# EAGLE design boardMaster (EAGLE 8.2.0)
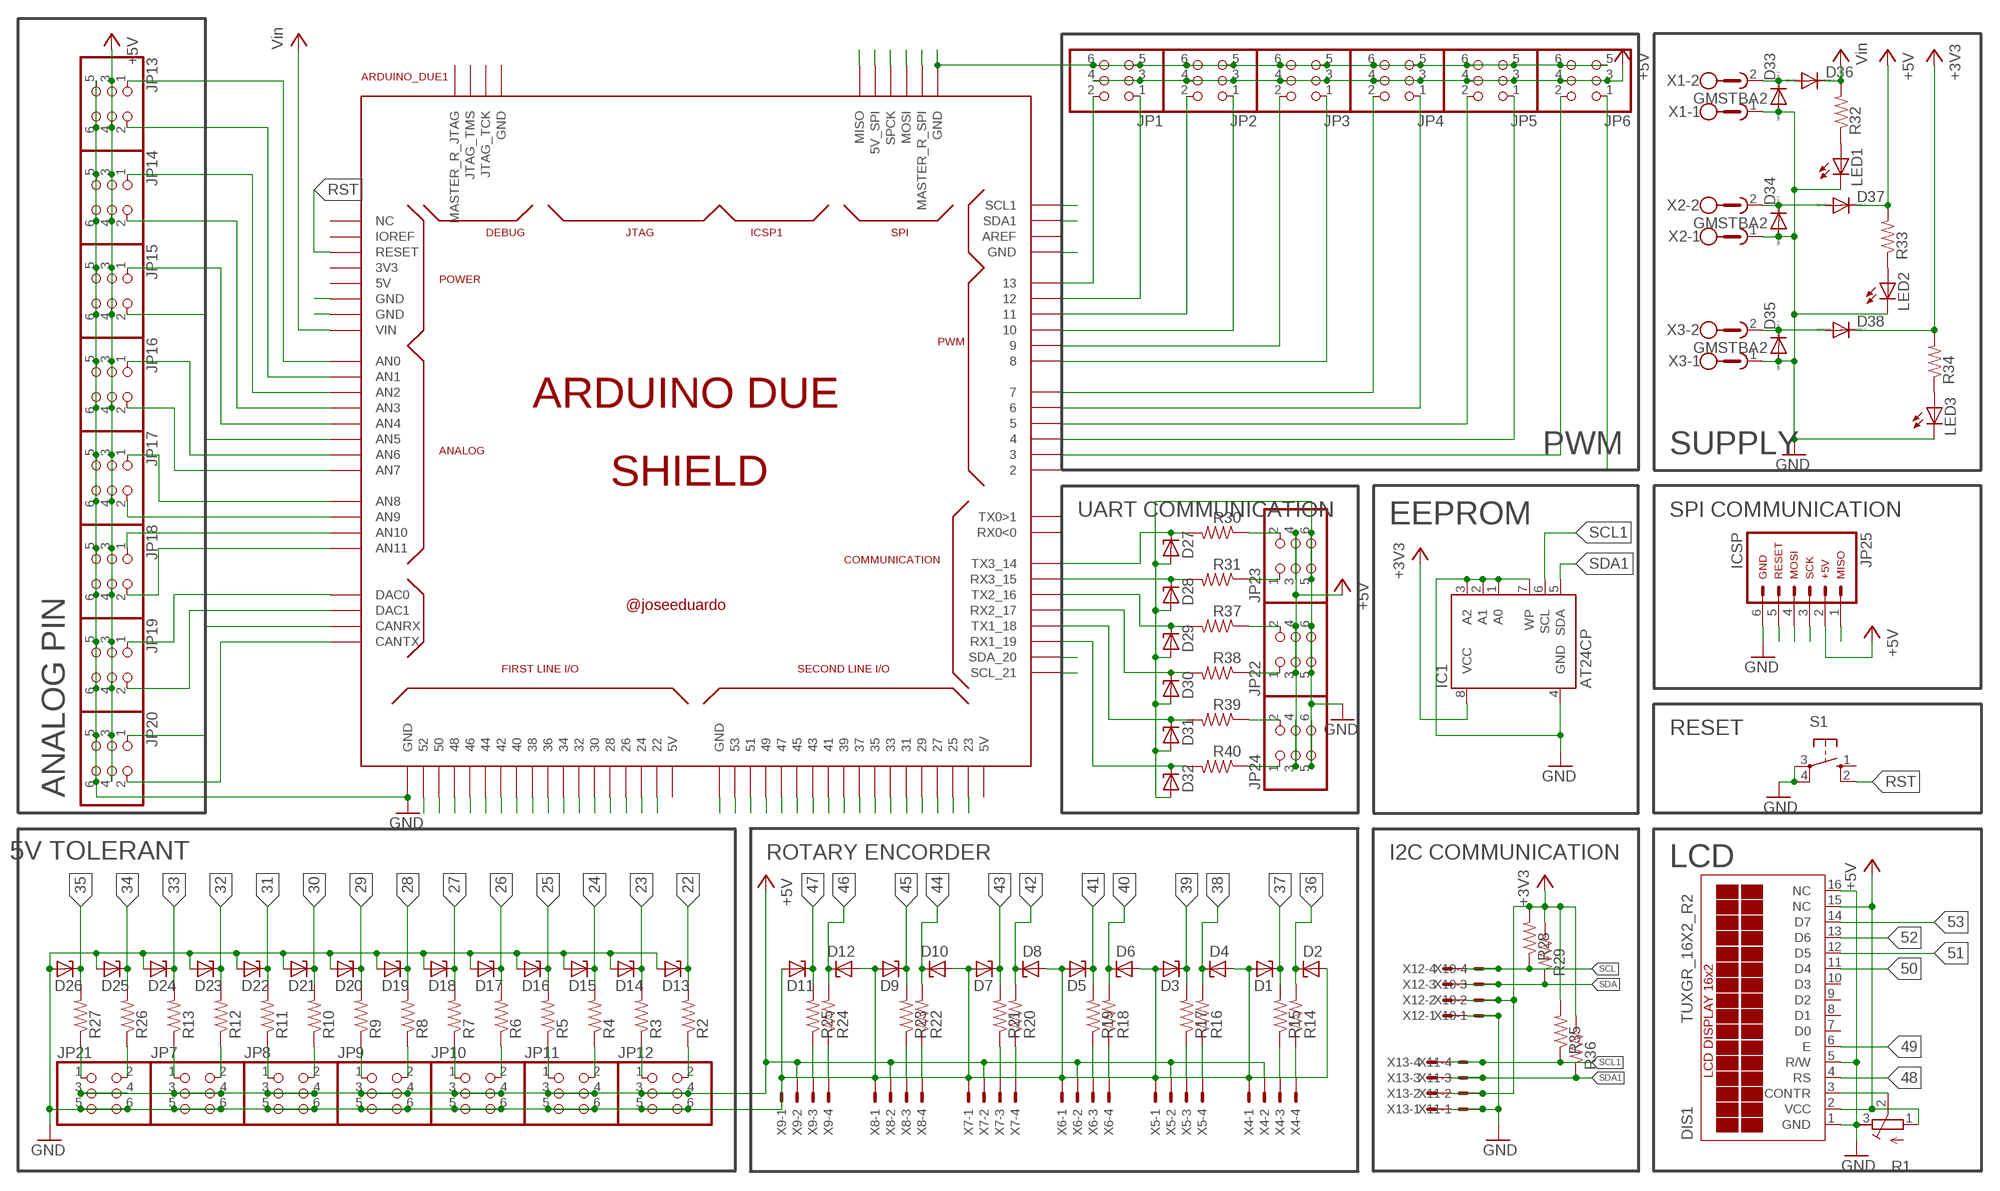
[diagram p0: schematic, sheet 1]

## Parts
ARDUINO_DUE1  ARDUINO_DUE_SHIELD  [ARDUINO_DUE_SHIELD]
D1  ZENER-DIODESOD80C  [SOD80C]
D2  ZENER-DIODESOD80C  [SOD80C]
D3  ZENER-DIODESOD80C  [SOD80C]
D4  ZENER-DIODESOD80C  [SOD80C]
D5  ZENER-DIODESOD80C  [SOD80C]
D6  ZENER-DIODESOD80C  [SOD80C]
D7  ZENER-DIODESOD80C  [SOD80C]
D8  ZENER-DIODESOD80C  [SOD80C]
D9  ZENER-DIODESOD80C  [SOD80C]
D10  ZENER-DIODESOD80C  [SOD80C]
D11  ZENER-DIODESOD80C  [SOD80C]
D12  ZENER-DIODESOD80C  [SOD80C]
D13  ZENER-DIODESOD80C  [SOD80C]
D14  ZENER-DIODESOD80C  [SOD80C]
D15  ZENER-DIODESOD80C  [SOD80C]
D16  ZENER-DIODESOD80C  [SOD80C]
D17  ZENER-DIODESOD80C  [SOD80C]
D18  ZENER-DIODESOD80C  [SOD80C]
D19  ZENER-DIODESOD80C  [SOD80C]
D20  ZENER-DIODESOD80C  [SOD80C]
D21  ZENER-DIODESOD80C  [SOD80C]
D22  ZENER-DIODESOD80C  [SOD80C]
D23  ZENER-DIODESOD80C  [SOD80C]
D24  ZENER-DIODESOD80C  [SOD80C]
D25  ZENER-DIODESOD80C  [SOD80C]
D26  ZENER-DIODESOD80C  [SOD80C]
D27  ZENER-DIODESOD80C  [SOD80C]
D28  ZENER-DIODESOD80C  [SOD80C]
D29  ZENER-DIODESOD80C  [SOD80C]
D30  ZENER-DIODESOD80C  [SOD80C]
D31  ZENER-DIODESOD80C  [SOD80C]
D32  ZENER-DIODESOD80C  [SOD80C]
D33  DIODE-DO214AA  [DO214AA]
D34  DIODE-DO214AA  [DO214AA]
D35  DIODE-DO214AA  [DO214AA]
D36  DIODE-DO214AA  [DO214AA]
D37  DIODE-DO214AA  [DO214AA]
D38  DIODE-DO214AA  [DO214AA]
DIS1  TUXGR_16X2_R2  [TUXGR_16X2_R2]
IC1  AT24CP  [DIL08]
JP1  PINHD-2X3  [2X03]
JP2  PINHD-2X3  [2X03]
JP3  PINHD-2X3  [2X03]
JP4  PINHD-2X3  [2X03]
JP5  PINHD-2X3  [2X03]
JP6  PINHD-2X3  [2X03]
JP7  PINHD-2X3  [2X03]
JP8  PINHD-2X3  [2X03]
JP9  PINHD-2X3  [2X03]
JP10  PINHD-2X3  [2X03]
JP11  PINHD-2X3  [2X03]
JP12  PINHD-2X3  [2X03]
JP13  PINHD-2X3  [2X03]
JP14  PINHD-2X3  [2X03]
JP15  PINHD-2X3  [2X03]
JP16  PINHD-2X3  [2X03]
JP17  PINHD-2X3  [2X03]
JP18  PINHD-2X3  [2X03]
JP19  PINHD-2X3  [2X03]
JP20  PINHD-2X3  [2X03]
JP21  PINHD-2X3  [2X03]
JP22  PINHD-2X3  [2X03]
JP23  PINHD-2X3  [2X03]
JP24  PINHD-2X3  [2X03]
JP25  ARDUINO_CONN-ICSP  [CONN-2X03]
LED1  LEDCHIPLED_1206  [CHIPLED_1206]
LED2  LEDCHIPLED_1206  [CHIPLED_1206]
LED3  LEDCHIPLED_1206  [CHIPLED_1206]
R1  R-TRIMM64W  [RTRIM64W]
R2  R-US_R0805  [R0805]
R3  R-US_R0805  [R0805]
R4  R-US_R0805  [R0805]
R5  R-US_R0805  [R0805]
R6  R-US_R0805  [R0805]
R7  R-US_R0805  [R0805]
R8  R-US_R0805  [R0805]
R9  R-US_R0805  [R0805]
R10  R-US_R0805  [R0805]
R11  R-US_R0805  [R0805]
R12  R-US_R0805  [R0805]
R13  R-US_R0805  [R0805]
R14  R-US_R0805  [R0805]
R15  R-US_R0805  [R0805]
R16  R-US_R0805  [R0805]
R17  R-US_R0805  [R0805]
R18  R-US_R0805  [R0805]
R19  R-US_R0805  [R0805]
R20  R-US_R0805  [R0805]
R21  R-US_R0805  [R0805]
R22  R-US_R0805  [R0805]
R23  R-US_R0805  [R0805]
R24  R-US_R0805  [R0805]
R25  R-US_R0805  [R0805]
R26  R-US_R0805  [R0805]
R27  R-US_R0805  [R0805]
R28  R-US_R0805  [R0805]
R29  R-US_R0805  [R0805]
R30  R-US_R0805  [R0805]
R31  R-US_R0805  [R0805]
R32  R-US_R0805  [R0805]
R33  R-US_R0805  [R0805]
R34  R-US_R0805  [R0805]
R35  R-US_R0805  [R0805]
R36  R-US_R0805  [R0805]
R37  R-US_R0805  [R0805]
R38  R-US_R0805  [R0805]
R39  R-US_R0805  [R0805]
R40  R-US_R0805  [R0805]
S1  40-XX  [B3F-40XX]
X1  GMSTBA2  [GMSTBA2]
X2  GMSTBA2  [GMSTBA2]
X3  GMSTBA2  [GMSTBA2]
X4  22-23-2041  [22-23-2041]
X5  22-23-2041  [22-23-2041]
X6  22-23-2041  [22-23-2041]
X7  22-23-2041  [22-23-2041]
X8  22-23-2041  [22-23-2041]
X9  22-23-2041  [22-23-2041]
X10  22-23-2041  [22-23-2041]
X11  22-23-2041  [22-23-2041]
X12  22-23-2041  [22-23-2041]
X13  22-23-2041  [22-23-2041]

## Nets
22: ARDUINO_DUE1.22 D13.C R2.2
23: ARDUINO_DUE1.23 D14.C R3.2
24: ARDUINO_DUE1.24 D15.C R4.2
25: ARDUINO_DUE1.25 D16.C R5.2
26: ARDUINO_DUE1.26 D17.C R6.2
27: ARDUINO_DUE1.27 D18.C R7.2
28: ARDUINO_DUE1.28 D19.C R8.2
29: ARDUINO_DUE1.29 D20.C R9.2
30: ARDUINO_DUE1.30 D21.C R10.2
31: ARDUINO_DUE1.31 D22.C R11.2
32: ARDUINO_DUE1.32 D23.C R12.2
33: ARDUINO_DUE1.33 D24.C R13.2
34: ARDUINO_DUE1.34 D25.C R26.2
35: ARDUINO_DUE1.35 D26.C R27.2
36: ARDUINO_DUE1.36 D2.C R14.2
37: ARDUINO_DUE1.37 D1.C R15.2
38: ARDUINO_DUE1.38 D4.C R16.2
39: ARDUINO_DUE1.39 D3.C R17.2
40: ARDUINO_DUE1.40 D6.C R18.2
41: ARDUINO_DUE1.41 D5.C R19.2
42: ARDUINO_DUE1.42 D8.C R20.2
43: ARDUINO_DUE1.43 D7.C R21.2
44: ARDUINO_DUE1.44 D10.C R22.2
45: ARDUINO_DUE1.45 D9.C R23.2
46: ARDUINO_DUE1.46 D12.C R24.2
47: ARDUINO_DUE1.47 D11.C R25.2
48: ARDUINO_DUE1.48 DIS1.4(RS)
49: ARDUINO_DUE1.49 DIS1.6(E)
50: ARDUINO_DUE1.50 DIS1.11(D4)
51: ARDUINO_DUE1.51 DIS1.12(D5)
52: ARDUINO_DUE1.52 DIS1.13(D6)
53: ARDUINO_DUE1.53 DIS1.14(D7)
+3V3: D38.C IC1.8(VCC) R28.2 R29.2 R34.2 R35.2 R36.2 X10.2 X11.2 X12.2 X13.2
+5V: ARDUINO_DUE1.5V_2(5V_SPI) D37.C DIS1.2(VCC) DIS1.15(NC) JP1.3 JP1.4 JP2.3 JP2.4 JP3.3 JP3.4 JP4.3 JP4.4 JP5.3 JP5.4 JP6.3 JP6.4 JP7.3 JP7.4 JP8.3 JP8.4 JP9.3 JP9.4 JP10.3 JP10.4 JP11.3 JP11.4 JP12.3 JP12.4 JP13.3 JP13.4 JP14.3 JP14.4 JP15.3 JP15.4 JP16.3 JP16.4 JP17.3 JP17.4 JP18.3 JP18.4 JP19.3 JP19.4 JP20.3 JP20.4 JP21.3 JP21.4 JP22.3 JP22.4 JP23.3 JP23.4 JP24.3 JP24.4 JP25.2 R1.1(A) R33.2 X4.2 X5.2 X6.2 X7.2 X8.2 X9.2
GND: ARDUINO_DUE1.GND ARDUINO_DUE1.GND_1(GND) ARDUINO_DUE1.GND_2(GND) ARDUINO_DUE1.GND_3(GND) ARDUINO_DUE1.GND_4(GND) ARDUINO_DUE1.GND_5(GND) D1.A D2.A D3.A D4.A D5.A D6.A D7.A D8.A D9.A D10.A D11.A D12.A D13.A D14.A D15.A D16.A D17.A D18.A D19.A D20.A D21.A D22.A D23.A D24.A D25.A D26.A D27.A D28.A D29.A D30.A D31.A D32.A D33.A D34.A D35.A DIS1.1(GND) DIS1.5(R/W) DIS1.16(NC) IC1.1(A0) IC1.2(A1) IC1.3(A2) IC1.4(GND) IC1.7(WP) JP1.5 JP1.6 JP2.5 JP2.6 JP3.5 JP3.6 JP4.5 JP4.6 JP5.5 JP5.6 JP6.5 JP6.6 JP7.5 JP7.6 JP8.5 JP8.6 JP9.5 JP9.6 JP10.5 JP10.6 JP11.5 JP11.6 JP12.5 JP12.6 JP13.5 JP13.6 JP14.5 JP14.6 JP15.5 JP15.6 JP16.5 JP16.6 JP17.5 JP17.6 JP18.5 JP18.6 JP19.5 JP19.6 JP20.5 JP20.6 JP21.5 JP21.6 JP22.5 JP22.6 JP23.5 JP23.6 JP24.5 JP24.6 JP25.6 LED1.C LED2.C LED3.C R1.3(E) S1.3(P) S1.4(P1) X1.1 X2.1 X3.1 X4.1 X5.1 X6.1 X7.1 X8.1 X9.1 X10.1 X11.1 X12.1 X13.1
MISO: ARDUINO_DUE1.MISO JP25.1
MOSI: ARDUINO_DUE1.MOSI JP25.4
N$1: ARDUINO_DUE1.A9(AN9) JP17.2
N$2: LED2.A R33.1
N$3: LED3.A R34.1
N$4: LED1.A R32.1
N$5: ARDUINO_DUE1.A0(AN0) JP13.1
N$7: ARDUINO_DUE1.A1(AN1) JP13.2
N$8: ARDUINO_DUE1.A2(AN2) JP14.1
N$9: ARDUINO_DUE1.A3(AN3) JP14.2
N$11: JP21.1 R27.1
N$12: JP21.2 R26.1
N$13: JP7.1 R13.1
N$14: JP7.2 R12.1
N$15: JP8.1 R11.1
N$16: JP8.2 R10.1
N$17: JP9.1 R9.1
N$18: JP9.2 R8.1
N$19: JP10.1 R7.1
N$20: JP10.2 R6.1
N$21: JP11.1 R5.1
N$22: JP11.2 R4.1
N$23: ARDUINO_DUE1.3 JP6.2
N$24: ARDUINO_DUE1.4 JP5.1
N$25: ARDUINO_DUE1.5 JP5.2
N$26: ARDUINO_DUE1.6 JP4.1
N$27: ARDUINO_DUE1.7 JP4.2
N$28: ARDUINO_DUE1.8 JP3.1
N$29: ARDUINO_DUE1.9 JP3.2
N$30: ARDUINO_DUE1.10 JP2.1
N$31: ARDUINO_DUE1.11 JP2.2
N$32: ARDUINO_DUE1.12 JP1.1
N$33: ARDUINO_DUE1.13 JP1.2
N$34: ARDUINO_DUE1.A4(AN4) JP15.1
N$35: ARDUINO_DUE1.A5(AN5) JP15.2
N$36: ARDUINO_DUE1.A6(AN6) JP16.1
N$37: ARDUINO_DUE1.A7(AN7) JP16.2
N$38: ARDUINO_DUE1.A8(AN8) JP17.1
N$39: D33.C D36.A X1.2
N$40: ARDUINO_DUE1.A10(AN10) JP18.1
N$41: ARDUINO_DUE1.A11(AN11) JP18.2
N$42: ARDUINO_DUE1.DAC0 JP19.1
N$43: ARDUINO_DUE1.DAC1 JP19.2
N$44: ARDUINO_DUE1.CANRX JP20.1
N$45: ARDUINO_DUE1.CANTX JP20.2
N$46: JP23.2 R30.1
N$47: JP23.1 R31.1
N$48: D34.C D37.A X2.2
N$49: D35.C D38.A X3.2
N$51: JP22.2 R37.1
N$52: JP22.1 R38.1
N$53: JP24.1 R40.1
N$54: R14.1 X4.4
N$55: JP24.2 R39.1
N$56: JP12.1 R3.1
N$57: JP12.2 R2.1
N$71: R15.1 X4.3
N$73: R16.1 X5.4
N$74: R17.1 X5.3
N$75: R18.1 X6.4
N$76: R19.1 X6.3
N$77: R20.1 X7.4
N$78: R21.1 X7.3
N$79: R22.1 X8.4
N$80: R23.1 X8.3
N$81: R24.1 X9.4
N$82: R25.1 X9.3
N$85: DIS1.3(CONTR) R1.2(S)
N$86: ARDUINO_DUE1.14(TX3_14) D27.C R30.2
N$87: ARDUINO_DUE1.15(RX3_15) D28.C R31.2
N$88: ARDUINO_DUE1.16(TX2_16) D29.C R37.2
N$89: ARDUINO_DUE1.17(RX2_17) D30.C R38.2
N$98: ARDUINO_DUE1.19(RX1_19) D32.C R40.2
N$99: ARDUINO_DUE1.2 JP6.1
N$100: ARDUINO_DUE1.18(TX1_18) D31.C R39.2
RST: ARDUINO_DUE1.RESET S1.2(S1)
SCK: ARDUINO_DUE1.SPCK JP25.3
SCL: ARDUINO_DUE1.21(SCL_21) R28.1 X10.4 X12.4
SCL1: ARDUINO_DUE1.SCL1 IC1.6(SCL) R35.1 X11.4 X13.4
SDA: ARDUINO_DUE1.20(SDA_20) R29.1 X10.3 X12.3
SDA1: ARDUINO_DUE1.SDA1 IC1.5(SDA) R36.1 X11.3 X13.3
SS: ARDUINO_DUE1.MASTER_RESET_SPI(MASTER_R_SPI) JP25.5
VCC: ARDUINO_DUE1.VIN D36.C R32.2 ; supply symbol labelled Vin
Unconnected: ARDUINO_DUE1.0(RX0<0) ARDUINO_DUE1.1(TX0>1) ARDUINO_DUE1.3V3 ARDUINO_DUE1.5V0(5V) ARDUINO_DUE1.5V0_1(5V) ARDUINO_DUE1.5V0_2(5V) ARDUINO_DUE1.AREF ARDUINO_DUE1.GND_7(GND) ARDUINO_DUE1.IOREF ARDUINO_DUE1.JTAG_TCK ARDUINO_DUE1.JTAG_TMS ARDUINO_DUE1.MASTER_RESET_JTAG(MASTER_R_JTAG) ARDUINO_DUE1.NC_2(NC) DIS1.7(D0) DIS1.8(D1) DIS1.9(D2) DIS1.10(D3) S1.1(S)

## Notes on the sheet
- PWM | SUPPLY
- UART COMMUNICATION | EEPROM | SPI COMMUNICATION
- RESET
- ANALOG PIN
- LCD
- 5V TOLERANT | ROTARY ENCORDER | I2C COMMUNICATION

## Library data of the parts
ARDUINO_DUE1 = arduino_due_shield:ARDUINO_DUE_SHIELD
D1-D32 = diode:ZENER-DIODE: Z-Diode
D33-D38 = diode:DIODE-: DIODE
DIS1 = display-lcd:TUXGR_16X2_R2: Tuxgraphics LCD display 16x2 characters reflective, without background light Source: tuxgr_12x2_r2.pdf; OC_FARNELL: unknown; OC_NEWARK: unknown
IC1 = atmel:AT24C*: 2-wire serial EEPROM; MPN: AT24C1024BW-SH-B; OC_FARNELL: 1362646; OC_NEWARK: 03P2044
JP1-JP24 = pinhead:PINHD-2X3: PIN HEADER
JP25 = arduino_jw:ARDUINO_CONN-ICSP: Arduino ICSP I/O Header This is the ICSP I/O header on the Arduino Uno R3. This connector is labeled with the following pin assignments: MISO +5V SCK MOSI RESET GND NOTE: Be sure you install this connector with the correct orientation on your PCB layout. Pin 1 has a square pad to assist with orientation.
LED1-LED3 = led:LED: LED OSRAM: - CHIPLED LG R971, LG N971, LY N971, LG Q971, LY Q971, LO R971, LY R971 LH N974, LH R974 LS Q976, LO Q976, LY Q976 LO Q996 - Hyper CHIPLED LW Q18S LB Q993, LB Q99A, LB R99A - SideLED LS A670, LO A670, LY A670, LG A670, LP A670 LB A673, LV A673, LT A673, LW A673 LH A674 LY A675 LS A676, LA A676, LO A676, LY A676, LW A676 LS A679, LY A679, LG A679 - Hyper Micro SIDELED® LS Y876, LA Y876, LO Y876, LY Y876 LT Y87S - SmartLED LW L88C, LW L88S LB L89C, LB L89S, LG L890 LS L89K, LO L89K, LY L89K LS L896, LA L896, LO L896, LY L896 - TOPLED LS T670, LO T670, LY T670, LG T670, LP T670 LSG T670, LSP T670, LSY T670, LOP T670, LYG T670 LG T671, LOG T671, LSG T671 LB T673, LV T673, LT T673, LW T673 LH T674 LS T676, LA T676, LO T676, LY T676, LB T676, LH T676, LSB T676, LW T676 LB T67C, LV T67C, LT T67C, LS T67K, LO T67K, LY T67K, LW E67C LS E67B, LA E67B, LO E67B, LY E67B, LB E67C, LV E67C, LT E67C LW T67C LS T679, LY T679, LG T679 LS T770, LO T770, LY T770, LG T770, LP T770 LB T773, LV T773, LT T773, LW T773 LH T774 LS E675, LA E675, LY E675, LS T675 LS T776, LA T776, LO T776, LY T776, LB T776 LHGB T686 LT T68C, LB T68C - Hyper Mini TOPLED® LB M676 - Mini TOPLED Santana® LG M470 LS M47K, LO M47K, LY M47K Source: http://www.osram.convergy.de LUXEON: - LUMILED® LXK2-PW12-R00, LXK2-PW12-S00, LXK2-PW14-U00, LXK2-PW14-V00 LXK2-PM12-R00, LXK2-PM12-S00, LXK2-PM14-U00 LXK2-PE12-Q00, LXK2-PE12-R00, LXK2-PE12-S00, LXK2-PE14-T00, LXK2-PE14-U00 LXK2-PB12-K00, LXK2-PB12-L00, LXK2-PB12-M00, LXK2-PB14-N00, LXK2-PB14-P00, LXK2-PB14-Q00 LXK2-PR12-L00, LXK2-PR12-M00, LXK2-PR14-Q00, LXK2-PR14-R00 LXK2-PD12-Q00, LXK2-PD12-R00, LXK2-PD12-S00 LXK2-PH12-R00, LXK2-PH12-S00 LXK2-PL12-P00, LXK2-PL12-Q00, LXK2-PL12-R00 Source: www.luxeon.com KINGBRIGHT: KA-3528ASYC Source: www.kingbright.com
R1 = rcl:R-TRIMM: Trimm resistor
R2-R40 = rcl:R-US_: RESISTOR, American symbol
S1 = switch-omron:40-XX: OMRON SWITCH
X1-X3 = con-phoenix-762:GMSTBA2: PHOENIX; MF: FARNELL; MPN: 1757242; OC_FARNELL: 3705171; OC_NEWARK: 71C4161
X4-X13 = con-molex:22-23-2041: .100" (2.54mm) Center Header - 4 Pin; MF: MOLEX; MPN: 22-23-2041; OC_FARNELL: 1462920; OC_NEWARK: 38C0355

## Board
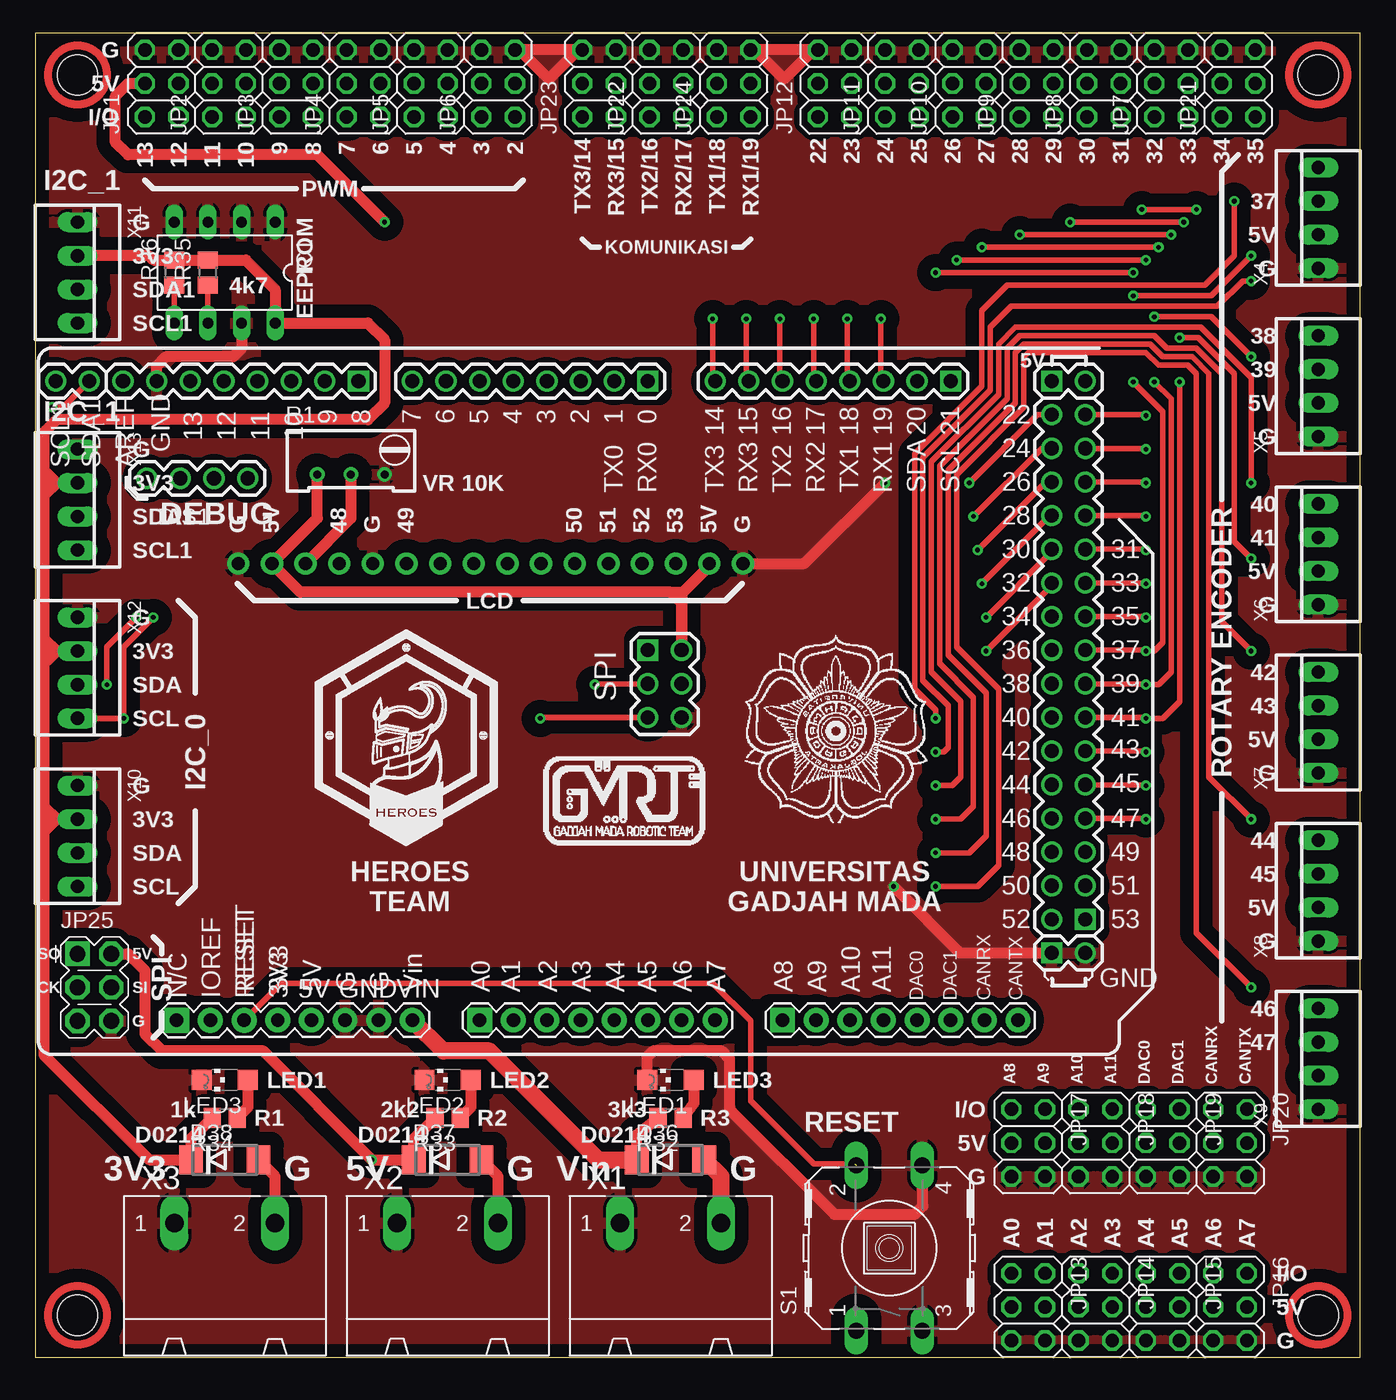
[diagram p1: board, top side]
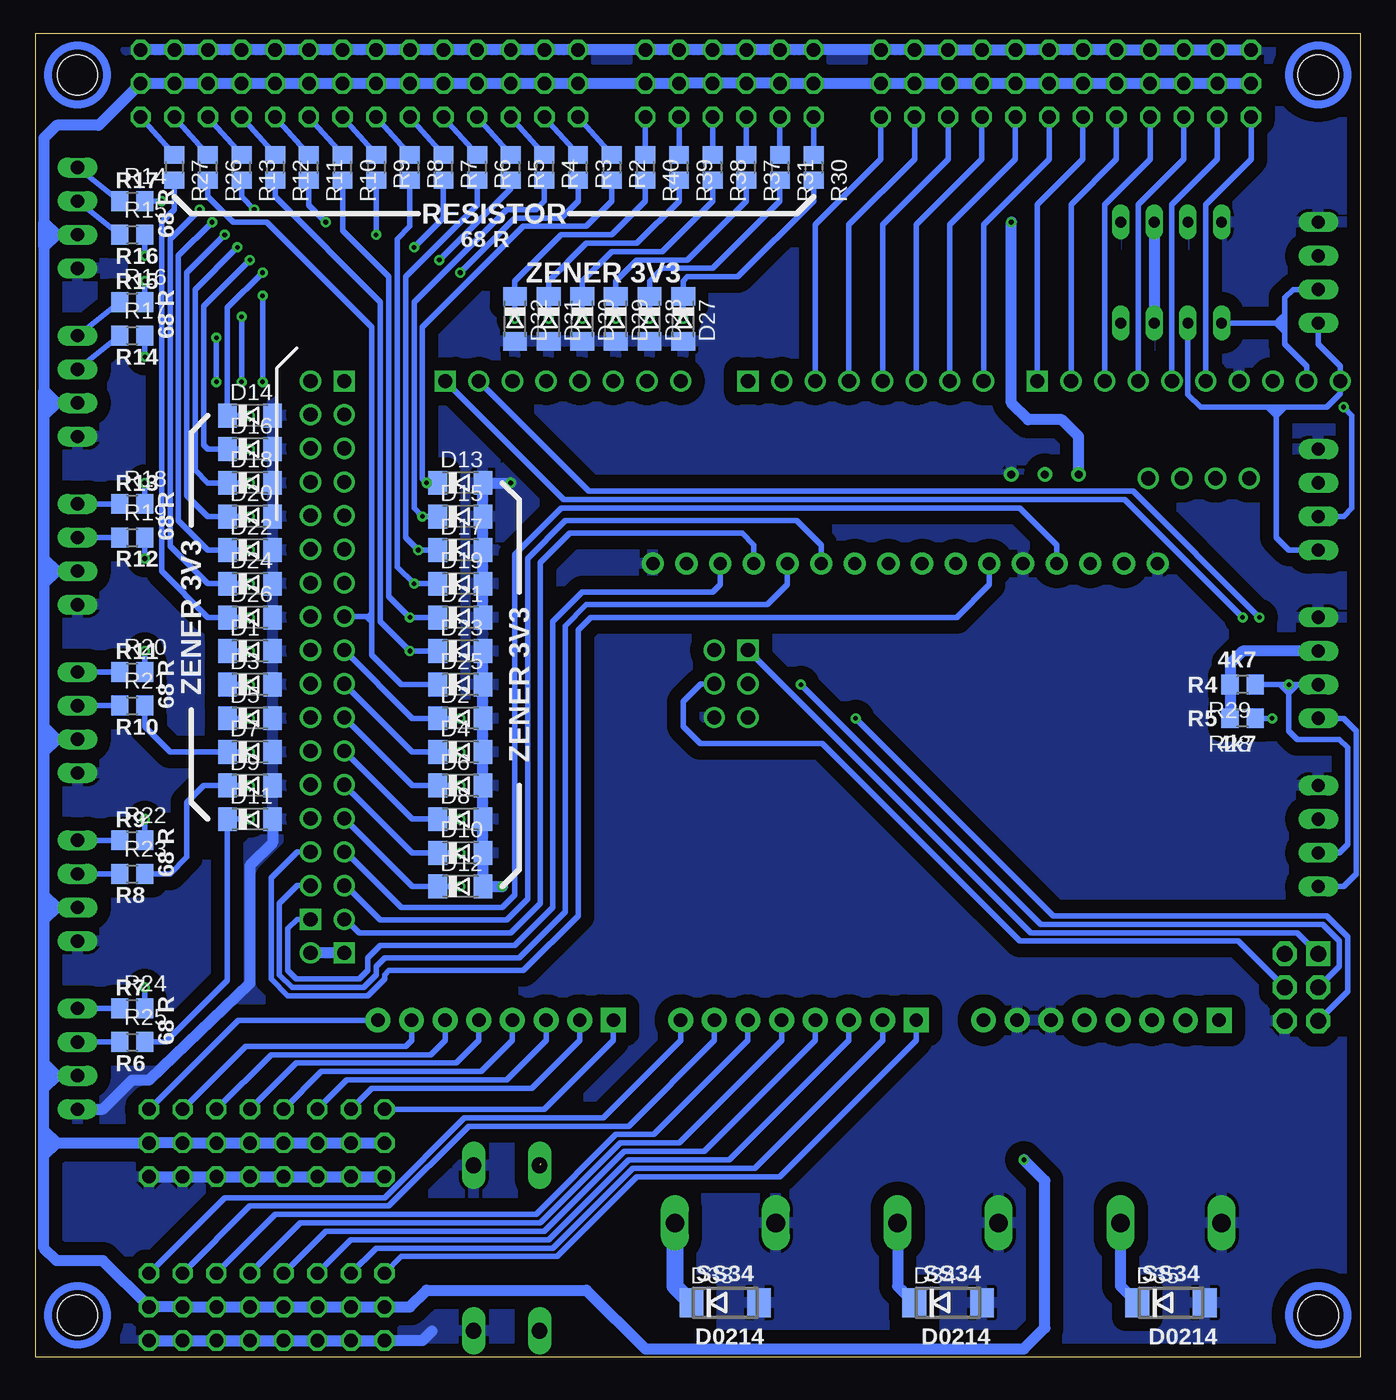
[diagram p2: board, bottom side, seen from below]

Size 100 x 100 mm. Coordinates in mm from the lower left corner, seen from the top.
Outline: 0,0 100,0 100,100 0,100 0,0
Copper layers (1*16): Top 0.035mm / dielectric 1.5mm / Bottom 0.035mm
Design rules "default": minimum track width 6mil, minimum drill 0.35mm, track to track 6mil, track to pad 6mil, pad to pad 6mil, via to via 6mil, smd to smd 6mil, copper to edge 40mil, drill to drill 6mil, minimum pad ring 10mil, minimum via ring 8mil, stop-mask expansion 4mil, vias tented up to drill 0mil, thermal gap 10mil

### Footprints (pad centres in the part's own frame; a part is rotated, then mirrored left to right if it is on the bottom)
ARDUINO_DUE_SHIELD = drill 1.067 square: 0 46.863,50.546; 5V0_1 77.343,50.546; 8 25.019,50.546; 21 69.723,50.546; 53 79.883,9.906; GND_2 77.343,7.366; MISO 46.863,30.226 | drill 1.067: 1 44.323,50.546; 2 41.783,50.546; 3 39.243,50.546; 4 36.703,50.546; 5 34.163,50.546; 5V0_2 79.883,50.546; 5V_2 49.403,30.226; 6 31.623,50.546; 7 29.083,50.546; 9 22.479,50.546; 10 19.939,50.546; 11 17.399,50.546; 12 14.859,50.546; 13 12.319,50.546; 14 51.943,50.546; 15 54.483,50.546; 16 57.023,50.546; 17 59.563,50.546; 18 62.103,50.546; 19 64.643,50.546; 20 67.183,50.546; 22 77.343,48.006; 23 79.883,48.006; 24 77.343,45.466; 25 79.883,45.466; 26 77.343,42.926; 27 79.883,42.926; 28 77.343,40.386; 29 79.883,40.386; 30 77.343,37.846; 31 79.883,37.846; 32 77.343,35.306; 33 79.883,35.306; 34 77.343,32.766; 35 79.883,32.766; 36 77.343,30.226; 37 79.883,30.226; 38 77.343,27.686; 39 79.883,27.686; 40 77.343,25.146; 41 79.883,25.146; 42 77.343,22.606; 43 79.883,22.606; 44 77.343,20.066; 45 79.883,20.066; 46 77.343,17.526; 47 79.883,17.526; 48 77.343,14.986; 49 79.883,14.986; 50 77.343,12.446; 51 79.883,12.446; 52 77.343,9.906; AREF 7.239,50.546; GND_3 79.883,7.366; GND_4 9.779,50.546; GND_5 49.403,25.146; GND_7 16.651,43.203; JTAG_TCK 14.111,43.203; JTAG_TMS 11.571,43.203; MASTER_RESET_JTAG 9.031,43.203; MASTER_RESET_SPI 46.863,25.146; MOSI 49.403,27.686; SCL1 2.159,50.546; SDA1 4.699,50.546; SPCK 46.863,27.686 | drill 1.016 pad 1.88: 3V3 18.923,2.286; 5V0 21.463,2.286; A1 36.703,2.286; A2 39.243,2.286; A3 41.783,2.286; A4 44.323,2.286; A5 46.863,2.286; A6 49.403,2.286; A7 51.943,2.286; A9 59.563,2.286; A10 62.103,2.286; A11 64.643,2.286; CANRX 72.263,2.286; CANTX 74.803,2.286; DAC0 67.183,2.286; DAC1 69.723,2.286; GND 24.003,2.286; GND_1 26.543,2.286; IOREF 13.836,2.273; RESET 16.383,2.285; VIN 29.083,2.286 | drill 1.016 pad 1.88 square: A0 34.163,2.286; A8 57.023,2.286; NC_2 11.296,2.273
SOD80C = smd 1.4 x 1.8: A 1.7,0; C -1.7,0
DO214AA = smd 1.8 x 2.2: A 2.55,0; C -2.55,0
TUXGR_16X2_R2 = drill 1 pad 1.676: 1 -32,15.5; 2 -29.46,15.5; 3 -26.92,15.5; 4 -24.38,15.5; 5 -21.84,15.5; 6 -19.3,15.5; 7 -16.76,15.5; 8 -14.22,15.5; 9 -11.68,15.5; 10 -9.14,15.5; 11 -6.6,15.5; 12 -4.06,15.5; 13 -1.52,15.5; 14 1.02,15.5; 15 3.56,15.5; 16 6.1,15.5
DIL08 = drill 0.813 long: 1 -3.81,-3.81; 2 -1.27,-3.81; 3 1.27,-3.81; 4 3.81,-3.81; 5 3.81,3.81; 6 1.27,3.81; 7 -1.27,3.81; 8 -3.81,3.81
2X03 = drill 1.016 octagon: 1 -2.54,-1.27; 2 -2.54,1.27; 3 0,-1.27; 4 0,1.27; 5 2.54,-1.27; 6 2.54,1.27
CONN-2X03 = drill 1.2 pad 1.829 square: 1 0,0 | drill 1.2 pad 1.829 octagon: 2 2.54,0; 3 0,-2.54; 4 2.54,-2.54; 5 0,-5.08; 6 2.54,-5.08
CHIPLED_1206 = smd 1.5 x 1.5: A 0,-1.75; C 0,1.75
RTRIM64W = drill 0.61: 1 1.27,-2.54; 2 1.27,0; 3 1.27,2.54
R0805 = smd 1.3 x 1.5: 1 -0.95,0; 2 0.95,0
B3F-40XX = drill 1.194 long: 1 -6.248,2.489; 2 6.248,2.489; 3 -6.248,-2.489; 4 6.248,-2.489
HOLE-3MM = hole 3.05: 0,0
GMSTBA2 = drill 1.397 long: 1 -3.81,5.08; 2 3.81,5.08
22-23-2041 = drill 1 long: 1 -3.81,0; 2 -1.27,0; 3 1.27,0; 4 3.81,0

### Placement (x,y rotation side)
ARDUINO_DUE1  -0.64,23.18 0 top
D1  83.82,53.34 0 bottom
D2  67.94,48.26 0 bottom
D3  83.82,50.8 0 bottom
D4  67.94,45.72 0 bottom
D5  83.82,48.26 0 bottom
D6  67.94,43.18 0 bottom
D7  83.82,45.72 0 bottom
D8  67.94,40.64 0 bottom
D9  83.82,43.18 0 bottom
D10  67.94,38.1 0 bottom
D11  83.82,40.64 0 bottom
D12  67.94,35.56 0 bottom
D13  67.94,66.04 0 bottom
D14  83.82,71.12 0 bottom
D15  67.94,63.5 0 bottom
D16  83.82,68.58 0 bottom
D17  67.94,60.96 0 bottom
D18  83.82,66.04 0 bottom
D19  67.94,58.42 0 bottom
D20  83.82,63.5 0 bottom
D21  67.94,55.88 0 bottom
D22  83.82,60.96 0 bottom
D23  67.94,53.34 0 bottom
D24  83.82,58.42 0 bottom
D25  67.94,50.8 0 bottom
D26  83.82,55.88 0 bottom
D27  51.12,78.42 270 bottom
D28  53.66,78.42 270 bottom
D29  56.2,78.42 270 bottom
D30  58.74,78.42 270 bottom
D31  61.28,78.42 270 bottom
D32  63.82,78.42 270 bottom
D33  47.94,4.13 0 bottom
D34  31.11,4.13 0 bottom
D35  14.29,4.13 0 bottom
D36  47.94,14.92 0 top
D37  31.11,14.92 0 top
D38  14.29,14.92 0 top
DIS1  47.31,44.45 0 top
IC1  14.29,81.92 180 top
JP1  9.53,96.2 90 top
JP2  14.61,96.2 90 top
JP3  19.68,96.2 90 top
JP4  24.77,96.2 90 top
JP5  29.84,96.2 90 top
JP6  34.92,96.2 90 top
JP7  85.72,96.2 90 top
JP8  80.64,96.2 90 top
JP9  75.56,96.2 90 top
JP10  70.48,96.2 90 top
JP11  65.41,96.2 90 top
JP12  60.33,96.2 90 top
JP13  74.93,3.81 270 top
JP14  80.01,3.81 270 top
JP15  85.09,3.81 270 top
JP16  90.17,3.81 270 top
JP17  74.93,16.19 270 top
JP18  80.01,16.19 270 top
JP19  85.09,16.19 270 top
JP20  90.17,16.19 270 top
JP21  90.81,96.2 90 top
JP22  47.62,96.2 90 top
JP23  42.55,96.2 90 top
JP24  52.7,96.2 90 top
JP25  3.17,30.48 0 top
LED1  47.94,20.95 90 top
LED2  31.11,20.95 90 top
LED3  14.29,20.95 90 top
R1  23.81,67.94 270 top
R2  56.52,89.85 270 bottom
R3  59.05,89.85 270 bottom
R4  61.59,89.85 270 bottom
R5  64.14,89.85 270 bottom
R6  66.67,89.85 270 bottom
R7  69.22,89.85 270 bottom
R8  71.75,89.85 270 bottom
R9  74.3,89.85 270 bottom
R10  76.83,89.85 270 bottom
R11  79.38,89.85 270 bottom
R12  81.92,89.85 270 bottom
R13  84.45,89.85 270 bottom
R14  92.71,87.31 0 bottom
R15  92.71,84.77 0 bottom
R16  92.71,79.69 0 bottom
R17  92.71,77.15 0 bottom
R18  92.71,64.45 0 bottom
R19  92.71,61.91 0 bottom
R20  92.71,51.75 0 bottom
R21  92.71,49.21 0 bottom
R22  92.71,39.05 0 bottom
R23  92.71,36.51 0 bottom
R24  92.71,26.35 0 bottom
R25  92.71,23.81 0 bottom
R26  87,89.85 270 bottom
R27  89.53,89.85 270 bottom
R28  8.89,48.26 180 bottom
R29  8.89,50.8 180 bottom
R30  41.27,89.85 270 bottom
R31  43.81,89.85 270 bottom
R32  47.94,18.1 180 top
R33  31.11,18.1 180 top
R34  14.29,18.1 180 top
R35  13.02,81.92 90 top
R36  10.48,81.92 90 top
R37  46.35,89.85 270 bottom
R38  48.9,89.85 270 bottom
R39  51.44,89.85 270 bottom
R40  53.98,89.85 270 bottom
S1  64.45,8.26 90 top
U$1  [HOLE-3MM]  3.17,96.84 0 top
U$2  [HOLE-3MM]  3.17,3.17 0 top
U$3  [HOLE-3MM]  96.84,3.17 0 top
U$4  [HOLE-3MM]  96.84,96.84 0 top
X1  47.94,5.08 0 top
X2  31.11,5.08 0 top
X3  14.29,5.08 0 top
X4  96.84,86.04 90 top
X5  96.84,73.34 90 top
X6  96.84,60.64 90 top
X7  96.84,47.94 90 top
X8  96.84,35.24 90 top
X9  96.84,22.54 90 top
X10  3.17,39.37 270 top
X11  3.17,81.92 270 top
X12  3.17,52.07 270 top
X13  3.17,64.77 270 top

### Tracks (layer width: path | path; a pad name or v marks a point on that pad's centre or on a via)
22  (via drill 0.35)
  Top 0.406: ARDUINO_DUE1.22 75.63,71.18 v70.48,66.04
  Bottom 0.406: D13.C v70.48,66.04 70.8,66.36 70.8,77.79 63.18,85.41 58.42,85.41 56.52,87.31 R2.2
23  (via drill 0.35)
  Top 0.406: ARDUINO_DUE1.23 83.76,71.18 v83.82,71.12 | v67.94,81.92 v82.87,81.92
  Bottom 0.406: v83.82,71.12 D14.C 85.52,79.26 v82.87,81.92 | R3.2 59.05,87.31 60.33,86.04 63.82,86.04 v67.94,81.92
24  (via drill 0.35)
  Top 0.406: ARDUINO_DUE1.24 75.95,68.64 v70.8,63.5
  Bottom 0.406: D15.C v70.8,63.5 71.44,64.14 71.44,79.69 64.45,86.68 62.23,86.68 61.59,87.31 R4.2
25  (via drill 0.35)
  Top 0.406: ARDUINO_DUE1.25 83.76,68.64 v83.82,68.58 | v69.53,82.87 v83.82,82.87
  Bottom 0.406: v83.82,68.58 D16.C 87,68.58 87.31,68.9 87.31,79.38 v83.82,82.87 | 63.82,88.58 R5.2 | R5.2 63.98,88.74 R5.2 | R5.2 64.14,88.27 v69.53,82.87
26  (via drill 0.35)
  Top 0.406: ARDUINO_DUE1.26 76.26,66.1 v71.12,60.96
  Bottom 0.406: D17.C v71.12,60.96 72.07,61.91 72.07,81.6 66.67,87 R6.2
27  (via drill 0.35)
  Top 0.406: ARDUINO_DUE1.27 83.76,66.1 v83.82,66.04 | v71.44,83.82 v84.77,83.82
  Bottom 0.406: v83.82,66.04 D18.C 87,66.04 87.95,66.99 87.95,80.64 v84.77,83.82 | R7.2 69.22,86.04 v71.44,83.82
28  (via drill 0.35)
  Top 0.406: ARDUINO_DUE1.28 76.58,63.56 v71.44,58.42
  Bottom 0.406: D19.C v71.44,58.42 72.71,59.69 72.71,84.45 71.75,85.41 R8.2
29  (via drill 0.35)
  Top 0.406: ARDUINO_DUE1.29 83.76,63.56 v83.82,63.5 | v74.3,84.77 v85.72,84.77
  Bottom 0.406: v83.82,63.5 D20.C 87,63.5 88.58,65.09 88.58,81.92 v85.72,84.77 | R9.2 v74.3,84.77
30  (via drill 0.35)
  Top 0.406: ARDUINO_DUE1.30 76.71,60.83 v71.75,55.88
  Bottom 0.406: D21.C v71.75,55.88 73.34,57.47 73.34,81.6 76.83,85.09 R10.2
31  (via drill 0.35)
  Top 0.406: ARDUINO_DUE1.31 83.76,61.02 v83.82,60.96 | v78.11,85.72 v86.68,85.72
  Bottom 0.406: v83.82,60.96 D22.C 87,60.96 89.22,63.18 89.22,83.19 v86.68,85.72 | R11.2 79.38,87 v78.11,85.72
32  (via drill 0.35)
  Top 0.406: ARDUINO_DUE1.32 76.71,58.29 v71.75,53.34
  Bottom 0.406: D23.C v71.75,53.34 73.98,55.56 73.98,79.69 81.92,87.63 R12.2
33  (via drill 0.35)
  Top 0.406: ARDUINO_DUE1.33 83.76,58.48 v83.82,58.42 | v83.5,86.68 v87.63,86.68
  Bottom 0.406: v83.82,58.42 D24.C 87,58.42 89.85,61.28 89.85,84.45 v87.63,86.68 | 84.14,88.9 R13.2 | R13.2 84.14,88.58 | R13.2 84.45,87.63 v83.5,86.68
34
  Bottom 0.406: D25.C 72.39,50.8 74.61,53.02 74.61,55.56 | 74.61,55.88 74.61,55.56 | 74.61,55.88 74.61,56.2 | ARDUINO_DUE1.34 74.68,55.94 74.61,55.88 | 74.61,55.56 74.93,55.88 | 74.61,56.2 74.93,55.88 | 74.93,55.88 74.61,55.88 | R26.2 87,87.63 85.09,85.72 82.55,85.72 74.61,77.79 74.61,56.2
35  (via drill 0.35)
  Top 0.406: ARDUINO_DUE1.35 83.76,55.94 v83.82,55.88
  Bottom 0.406: v83.82,55.88 D26.C 87,55.88 90.49,59.37 90.49,85.72 89.53,86.68 R27.2
36  (via drill 0.35)
  Top 0.406: v67.94,48.26 67.94,48.9 66.36,50.48 66.36,68.26 71.44,73.34 71.44,79.06 73.34,80.96 88.27,80.96 90.49,83.19 v90.49,87.31
  Bottom 0.406: ARDUINO_DUE1.36 71.56,48.26 D2.C v67.94,48.26 | v90.49,87.31 R14.2
37  (via drill 0.35)
  Top 0.406: ARDUINO_DUE1.37 83.76,53.4 v83.82,53.34 84.45,53.34 85.09,53.98 85.09,71.44 v82.87,73.66 | 83.34,80.17 v82.87,80.17 88.74,80.17 v91.76,83.19
  Bottom 0.406: D1.C v83.82,53.34 | v82.87,73.66 v82.87,80.17 | v91.76,83.19 R15.2
38  (via drill 0.35)
  Top 0.406: v67.94,45.72 68.58,45.72 68.9,46.04 68.9,49.21 66.99,51.12 66.99,67.94 72.07,73.03 72.07,77.79 73.66,79.38 89.22,79.38 91.12,81.28 v91.76,81.28
  Bottom 0.406: ARDUINO_DUE1.38 71.56,45.72 D4.C v67.94,45.72 | v91.76,81.28 R16.2
39  (via drill 0.35)
  Top 0.406: ARDUINO_DUE1.39 83.76,50.86 v83.82,50.8 84.77,50.8 85.72,51.75 85.72,72.39 v84.45,73.66 | v91.76,75.56 88.74,78.58 v84.45,78.58
  Bottom 0.406: v83.82,50.8 D3.C | v84.45,73.66 v84.45,78.58 | v91.76,75.56 R17.2
40  (via drill 0.35)
  Top 0.406: v67.94,43.18 69.22,43.18 69.85,43.81 69.85,49.53 67.63,51.75 67.63,67.63 72.71,72.71 72.71,76.52 73.98,77.79 87.95,77.79 91.76,73.98 v91.76,66.04
  Bottom 0.406: ARDUINO_DUE1.40 71.56,43.18 D6.C v67.94,43.18 | R18.2 v91.76,66.04
41  (via drill 0.35)
  Top 0.406: ARDUINO_DUE1.41 83.76,48.32 v83.82,48.26 85.09,48.26 86.36,49.53 v86.36,73.66 | v86.36,76.99 87.79,76.99 90.49,74.3 90.49,61.6 v91.76,60.33
  Bottom 0.406: R19.2 v91.76,60.33 91.76,62.23 | v83.82,48.26 D5.C | v86.36,73.66 v86.36,76.99
42  (via drill 0.35)
  Top 0.406: v67.94,40.64 69.85,40.64 70.8,41.59 70.8,49.85 68.26,52.39 68.26,67.31 73.34,72.39 73.34,76.2 74.3,77.15 84.45,77.15 85.41,76.2 87.63,76.2 89.53,74.3 89.53,55.56 v91.76,53.34
  Bottom 0.406: R20.2 v91.76,53.34 | ARDUINO_DUE1.42 71.56,40.64 D8.C v67.94,40.64
43  (via drill 0.35)
  Top 0.406: ARDUINO_DUE1.43 83.76,45.78 v83.82,45.72
  Bottom 0.406: v83.82,45.72 D7.C 89.85,45.72 91.76,47.62 R21.2
44  (via drill 0.35)
  Top 0.406: v67.94,38.1 70.48,38.1 71.75,39.37 71.75,50.16 68.9,53.02 68.9,66.99 73.98,72.07 73.98,75.88 74.61,76.52 84.14,76.52 85.09,75.56 87.31,75.56 88.58,74.3 88.58,47.31 88.58,45.72 88.58,43.81 v91.76,40.64
  Bottom 0.406: ARDUINO_DUE1.44 71.56,38.1 D10.C v67.94,38.1 | v91.76,40.64 R22.2
45  (via drill 0.35)
  Top 0.406: ARDUINO_DUE1.45 83.76,43.24 v83.82,43.18
  Bottom 0.406: v83.82,43.18 D9.C 87.31,43.18 88.58,41.91 88.58,37.78 89.85,36.51 R23.2 91.12,36.51
46  (via drill 0.35)
  Top 0.406: v67.94,35.56 71.12,35.56 72.71,37.15 72.71,50.48 69.53,53.66 69.53,66.67 74.61,71.75 74.61,75.56 74.93,75.88 83.82,75.88 84.77,74.93 87,74.93 87.63,74.3 87.63,32.07 v91.76,27.94
  Bottom 0.406: ARDUINO_DUE1.46 71.56,35.56 D12.C v67.94,35.56 | v91.76,27.94 R24.2
47  (via drill 0.35)
  Top 0.406: ARDUINO_DUE1.47 83.76,40.7 v83.82,40.64
  Bottom 0.406: v83.82,40.64 D11.C 85.52,28.46 90.17,23.81 R25.2
48
  Bottom 0.406: ARDUINO_DUE1.48 76.58,38.16 72.39,33.97 64.77,33.97 63.82,34.92 63.82,60.64 60.33,64.14 25.72,64.14 22.93,61.34 DIS1.4
49
  Bottom 0.406: ARDUINO_DUE1.49 80.26,38.16 82.23,36.2 82.23,28.57 80.96,27.3 74.93,27.3 73.66,28.57 73.66,28.89 73.34,29.21 63.18,29.21 59.05,33.34 59.05,54.93 58.1,55.88 30.48,55.88 28.01,58.35 DIS1.6
50
  Bottom 0.406: ARDUINO_DUE1.50 76.58,35.62 73.98,33.02 64.45,33.02 62.87,34.61 62.87,60.33 60.01,63.18 42.55,63.18 40.71,61.34 DIS1.11
51
  Bottom 0.406: ARDUINO_DUE1.51 80.26,35.62 81.6,34.29 81.6,28.89 80.64,27.94 75.25,27.94 74.3,28.89 74.3,29.53 73.66,30.16 63.5,30.16 60.01,33.66 60.01,55.24 58.42,56.83 44.77,56.83 43.25,58.35 DIS1.12
52
  Bottom 0.406: ARDUINO_DUE1.52 76.58,33.08 75.56,32.07 64.14,32.07 61.91,34.29 61.91,60.01 59.69,62.23 46.67,62.23 45.79,61.34 DIS1.13
53
  Bottom 0.406: ARDUINO_DUE1.53 80.26,33.08 80.96,32.38 80.96,29.21 80.33,28.57 75.56,28.57 74.93,29.21 74.93,30.16 73.98,31.11 63.82,31.11 60.96,33.97 60.96,55.56 58.74,57.78 48.9,57.78 48.33,58.35 DIS1.14
+3V3
  Top 0.406: 13.02,83.19 R35.2
  Top 0.813: X11.2 8.57,83.19 8.89,82.86 R36.2 R35.2 15.88,82.86 18.1,80.64 IC1.8 25.08,78.11 26.35,76.83 26.35,72.07 25.08,70.8 1.59,70.8 0.64,69.85 0.64,66.99 | R34.2 11.74,16.5 D38.C 8.57,14.92 0.64,22.86 0.64,39.69 | 1.27,66.36 1.59,66.04 | X13.2 1.59,66.04 | 1.59,66.04 0.64,65.09 | 0.64,65.09 0.64,54.29 | 0.64,54.29 1.59,53.34 | X12.2 1.59,53.34 | 1.59,53.34 0.95,52.7 | 0.64,52.39 0.64,41.59 | 0.64,41.59 1.59,40.64 | X10.2 1.59,40.64 | 1.59,40.64 0.64,39.69 | 0.64,65.09 0.64,66.99 | 0.64,66.99 1.27,66.36 | 1.27,66.36 1.27,65.72 | 0.64,54.29 0.64,52.39 | 0.64,52.39 0.95,52.7 | 0.95,52.7 0.95,53.66 | 0.64,39.69 0.64,41.59
  Bottom 0.813: X12.2 8.89,53.34 9.84,52.39 R29.2 R28.2
+5V  (via drill 0.35)
  Top 0.813: R1.1 21.27,63.38 DIS1.2 20,57.78 47.94,57.78 | R33.2 28.57,16.5 D37.C v25.4,14.92 17.14,23.18 9.53,23.18 8.26,24.45 8.26,29.21 6.99,30.48 JP25.2 | v26.35,85.72 21.27,90.81 6.99,90.81 6.03,91.76 6.03,95.25 6.99,96.2 JP1.4 | DIS1.15 50.87,59.76 48.9,57.78 48.58,57.78 | 47.94,57.78 48.58,57.78 | 48.58,57.78 48.77,57.59 ARDUINO_DUE1.5V_2 48.77,56.96 47.94,57.78
  Bottom 0.813: JP1.4 JP1.3 JP2.4 JP2.3 JP3.4 JP3.3 JP4.4 JP4.3 JP5.4 JP5.3 JP6.4 JP6.3 JP23.4 JP23.3 JP22.4 JP22.3 JP24.4 JP24.3 JP12.4 JP12.3 JP11.4 JP11.3 JP10.4 JP10.3 JP9.4 JP9.3 JP8.4 JP8.3 JP7.4 JP7.3 JP21.4 JP21.3 95.25,93.03 98.42,93.03 99.38,92.08 99.38,85.72 | 98.42,84.77 X4.2 | 99.38,83.82 99.38,73.03 | 99.38,73.03 98.42,72.07 | 98.42,84.77 99.38,83.82 | X5.2 98.42,72.07 | 98.42,72.07 99.38,71.12 99.38,60.33 98.42,59.37 | X6.2 98.42,59.37 | 98.42,59.37 99.38,58.42 99.38,47.62 98.42,46.67 | X7.2 98.42,46.67 | 98.42,46.67 99.38,45.72 99.38,34.92 98.42,33.97 | X8.2 98.42,33.97 | 98.42,33.97 99.38,33.02 99.38,22.23 98.42,21.27 | X9.2 98.42,21.27 | 99.38,20.32 98.42,21.27 | JP17.3 JP17.4 JP18.3 JP18.4 JP19.3 JP19.4 JP20.3 JP20.4 98.42,16.19 | 99.38,20.32 99.38,73.03 | 99.38,17.14 98.42,16.19 | 99.38,17.14 99.38,20.32 | 99.38,15.24 99.38,8.26 98.42,7.3 94.93,7.3 JP16.4 JP16.3 JP15.4 JP15.3 JP14.4 JP14.3 JP13.4 JP13.3 71.75,3.81 70.48,5.08 58.42,5.08 53.98,0.64 25.4,0.64 23.81,2.22 23.81,13.34 v25.4,14.92 | 99.38,15.24 98.42,16.19 | 99.38,15.24 99.38,17.14 | 99.38,85.72 98.42,84.77 | 99.38,83.82 99.38,85.72 | R1.1 21.27,69.53 22.54,70.8 25.08,70.8 26.35,72.07 v26.35,85.72
GND  (via drill 0.35)
  Top 0.813: v64.77,35.56 69.79,30.54 ARDUINO_DUE1.GND_2 | DIS1.16 58.05,59.95 v64.14,66.04 | LED1.C 46.19,22.7 46.67,23.18 51.75,23.18 52.39,22.54 52.39,18.73 60.33,10.79 66.36,10.79 66.99,11.43 66.99,14.45 | IC1.7 15.56,76.2 14.92,75.56 9.84,75.56 9.14,74.87 ARDUINO_DUE1.GND_4 | 58.74,98.74 JP24.5 54.29,98.74 56.52,96.52 58.74,98.74 | 58.74,98.74 59.05,99.06 | JP12.6 58.74,98.74 | JP23.6 JP6.5 36.51,98.74 38.73,96.52 40.96,98.74 JP23.6
  Bottom 0.813: JP1.6 JP1.5 JP2.6 JP2.5 JP3.6 JP3.5 JP4.6 JP4.5 JP5.6 JP5.5 JP6.6 JP6.5 40.96,98.74 41.27,99.06 | JP20.6 JP20.5 JP19.6 JP19.5 JP18.6 JP18.5 JP17.6 JP17.5 | JP16.6 JP16.5 JP15.6 JP15.5 JP14.6 JP14.5 JP13.6 JP13.5 70.8,1.27 70.07,2.01 | ARDUINO_DUE1.GND_2 ARDUINO_DUE1.GND_3 | D23.A D25.A D2.A D4.A D6.A D8.A D10.A D12.A v64.77,35.56 | D21.A D19.A D17.A D15.A D13.A v64.14,66.04 | X9.1 94.93,18.73 92.71,20.95 91.44,20.95 83.82,28.26 83.82,37.15 82.12,38.85 D11.A | IC1.2 IC1.7 | JP23.6 JP23.5 JP22.6 JP22.5 JP24.6 JP24.5 JP12.6 JP12.5 JP11.6 JP11.5 JP10.6 JP10.5 JP9.6 JP9.5 JP8.6 JP8.5 JP7.6 JP7.5 JP21.6 JP21.5
  pour Bottom (isolate 1.016): 0,100.33 0,0 100.33,0 100.33,100.33
  pour Top (isolate 1.016): -0.64,100.33 -0.64,0 100.33,0 100.33,100.33
MISO
  Bottom 0.406: JP25.1 4.76,32.07 24.89,32.07 ARDUINO_DUE1.MISO
MOSI
  Bottom 0.406: JP25.4 9.21,31.43 25.72,31.43 40.64,46.35 49.85,46.35 51.12,47.62 51.12,49.53 49.78,50.86 ARDUINO_DUE1.MOSI
N$1
  Bottom 0.406: ARDUINO_DUE1.A9 58.93,23.94 62.55,20.32 74.61,20.32 JP17.2
N$2
  Top 0.813: LED2.A 32.87,18.9 R33.1
N$3
  Top 0.813: LED3.A 16.04,18.9 R34.1
N$4
  Top 0.813: LED1.A 49.69,19.21 R32.1
N$5
  Bottom 0.406: ARDUINO_DUE1.A0 33.53,23.94 43.81,13.65 54.61,13.65 60.64,7.62 72.39,7.62 JP13.1
N$7
  Bottom 0.406: ARDUINO_DUE1.A1 36.07,23.94 45.72,14.29 54.93,14.29 60.96,8.26 74.3,8.26 JP13.2
N$8
  Bottom 0.406: ARDUINO_DUE1.A2 38.61,23.94 47.62,14.92 55.24,14.92 61.28,8.89 76.2,8.89 JP14.1
N$9
  Bottom 0.406: ARDUINO_DUE1.A3 41.15,23.94 49.53,15.56 55.56,15.56 61.59,9.53 78.11,9.53 JP14.2
N$11
  Bottom 0.406: JP21.1 R27.1
N$12
  Bottom 0.406: JP21.2 R26.1
N$13
  Bottom 0.406: JP7.1 R13.1
N$14
  Bottom 0.406: JP7.2 R12.1
N$15
  Bottom 0.406: JP8.1 R11.1
N$16
  Bottom 0.406: JP8.2 R10.1
N$17
  Bottom 0.406: JP9.1 R9.1
N$18
  Bottom 0.406: JP9.2 R8.1
N$19
  Bottom 0.406: JP10.1 R7.1
N$20
  Bottom 0.406: JP10.2 R6.1
N$21
  Bottom 0.406: JP11.1 R5.1
N$22
  Bottom 0.406: JP11.2 R4.1
N$23
  Bottom 0.406: ARDUINO_DUE1.3 38.61,85.53 33.66,90.49 JP6.2
N$24
  Bottom 0.406: ARDUINO_DUE1.4 36.07,85.53 31.11,90.49 JP5.1
N$25
  Bottom 0.406: ARDUINO_DUE1.5 33.53,85.53 28.57,90.49 JP5.2
N$26
  Bottom 0.406: ARDUINO_DUE1.6 30.99,85.53 26.04,90.49 JP4.1
N$27
  Bottom 0.406: ARDUINO_DUE1.7 28.45,85.53 23.5,90.49 JP4.2
N$28
  Bottom 0.406: JP3.1 20.95,90.49 24.38,87.06 ARDUINO_DUE1.8
N$29
  Bottom 0.406: JP3.2 18.41,90.49 21.84,87.06 ARDUINO_DUE1.9
N$30
  Bottom 0.406: JP2.1 15.88,90.49 19.3,87.06 ARDUINO_DUE1.10
N$31
  Bottom 0.406: JP2.2 13.34,90.49 16.76,87.06 ARDUINO_DUE1.11
N$32
  Bottom 0.406: JP1.1 10.79,90.49 14.22,87.06 ARDUINO_DUE1.12
N$33
  Bottom 0.406: JP1.2 8.26,90.49 11.68,87.06 ARDUINO_DUE1.13
N$34
  Bottom 0.406: ARDUINO_DUE1.A4 43.69,23.94 51.44,16.19 55.88,16.19 61.91,10.16 80.01,10.16 JP15.1
N$35
  Bottom 0.406: ARDUINO_DUE1.A5 46.23,23.94 53.34,16.83 56.2,16.83 62.23,10.79 81.92,10.79 JP15.2
N$36
  Bottom 0.406: ARDUINO_DUE1.A6 48.77,23.94 55.24,17.46 67.31,17.46 73.34,11.43 83.82,11.43 JP16.1
N$37
  Bottom 0.406: ARDUINO_DUE1.A7 51.31,23.94 57.15,18.1 67.63,18.1 73.66,12.06 85.72,12.06 JP16.2
N$38
  Bottom 0.406: ARDUINO_DUE1.A8 56.39,23.94 61.59,18.73 JP17.1
N$39
  Top 1.27: D36.A 51.75,13.66 X1.2
  Bottom 1.27: D33.C 51.75,5.39 X1.2
N$40
  Bottom 0.406: ARDUINO_DUE1.A10 61.47,23.94 64.45,20.95 76.52,20.95 JP18.1
N$41
  Bottom 0.406: ARDUINO_DUE1.A11 64.01,23.94 66.36,21.59 78.42,21.59 JP18.2
N$42
  Bottom 0.406: ARDUINO_DUE1.DAC0 66.55,23.94 68.26,22.23 80.33,22.23 JP19.1
N$43
  Bottom 0.406: ARDUINO_DUE1.DAC1 69.09,23.94 70.17,22.86 82.23,22.86 JP19.2
N$44
  Bottom 0.406: ARDUINO_DUE1.CANRX 71.63,23.94 72.07,23.5 84.14,23.5 JP20.1
N$45
  Bottom 0.406: ARDUINO_DUE1.CANTX 84.71,25.46 JP20.2
N$46
  Bottom 0.406: JP23.2 R30.1
N$47
  Bottom 0.406: JP23.1 R31.1
N$48
  Top 0.813: D37.A 34.92,13.66 X2.2
  Bottom 0.813: 34.61,5.08 D34.C | 34.61,5.08 34.92,5.39 | X2.2 34.92,5.39 | 34.92,5.39 34.61,5.08
N$49
  Top 0.813: D38.A 18.1,13.66 X3.2
  Bottom 0.813: D35.C 18.1,5.39 X3.2
N$50
  Top 0.813: 0.95,40.64 1.27,40.64
N$51
  Bottom 0.406: JP22.2 R37.1
N$52
  Bottom 0.406: JP22.1 R38.1
N$53
  Bottom 0.406: JP24.1 R40.1
N$54
  Bottom 0.406: R14.1 X4.4
N$55
  Bottom 0.406: JP24.2 R39.1
N$56
  Bottom 0.406: JP12.1 R3.1
N$57
  Bottom 0.406: JP12.2 R2.1
N$71
  Bottom 0.406: R15.1 X4.3
N$73
  Bottom 0.406: R16.1 X5.4
N$74
  Bottom 0.406: R17.1 X5.3
N$75
  Bottom 0.406: R18.1 X6.4
N$76
  Bottom 0.406: R19.1 X6.3
N$77
  Bottom 0.406: R20.1 X7.4
N$78
  Bottom 0.406: R21.1 X7.3
N$79
  Bottom 0.406: R22.1 X8.4
N$80
  Bottom 0.406: R23.1 X8.3
N$81
  Bottom 0.406: X9.4 R24.1
N$82
  Bottom 0.406: X9.3 R25.1
N$85
  Top 0.813: R1.2 23.81,63.38 DIS1.3
N$86  (via drill 0.35)
  Top 0.406: v51.12,78.42 51.12,73.91 ARDUINO_DUE1.14
  Bottom 0.406: R30.2 41.27,87.31 46.99,81.6 50.8,81.6 51.12,81.28 D27.C v51.12,78.42
N$87  (via drill 0.35)
  Top 0.406: v53.66,78.42 53.66,73.91 ARDUINO_DUE1.15
  Bottom 0.406: R31.2 43.81,87.31 48.9,82.23 52.7,82.23 53.66,81.28 D28.C v53.66,78.42
N$88  (via drill 0.35)
  Top 0.406: v56.2,78.42 56.2,73.91 ARDUINO_DUE1.16
  Bottom 0.406: R37.2 46.35,87.31 50.8,82.87 54.61,82.87 56.2,81.28 D29.C v56.2,78.42
N$89  (via drill 0.35)
  Top 0.406: v58.74,78.42 58.74,73.91 ARDUINO_DUE1.17
  Bottom 0.406: R38.2 48.9,87.31 52.7,83.5 56.52,83.5 58.74,81.28 D30.C v58.74,78.42
N$98  (via drill 0.35)
  Top 0.406: v63.82,78.42 63.82,73.91 ARDUINO_DUE1.19
  Bottom 0.406: R40.2 53.98,87.31 56.52,84.77 60.33,84.77 63.82,81.28 D32.C v63.82,78.42
N$99
  Bottom 0.406: ARDUINO_DUE1.2 41.15,85.53 36.2,90.49 JP6.1
N$100  (via drill 0.35)
  Top 0.406: v61.28,78.42 61.28,73.91 ARDUINO_DUE1.18
  Bottom 0.406: R39.2 51.44,87.31 54.61,84.14 58.42,84.14 61.28,81.28 D31.C v61.28,78.42
RST  (1 unrouted)
  Top 0.406: 61.86,14.61 58.74,14.61 53.98,19.37 53.98,25.4 51.12,28.26 18.54,28.26 ARDUINO_DUE1.RESET
SCK  (via drill 0.35)
  Top 0.406: ARDUINO_DUE1.SPCK 42.29,50.86 v42.23,50.8
  Bottom 0.406: JP25.3 1.59,29.53 1.59,31.43 2.86,32.7 24.13,32.7 v42.23,50.8
SCL  (via drill 0.35)
  Top 0.406: X12.4 v6.67,48.26 6.67,53.66 v8.89,55.88
  Bottom 0.406: ARDUINO_DUE1.21 60.13,64.77 17.78,64.77 v8.89,55.88 | X10.4 1.27,35.56 0.32,36.51 0.32,47.31 1.27,48.26 X12.4 | R28.1 v6.67,48.26
SCL1
  Top 0.406: R35.1 IC1.6
  Bottom 0.406: X11.4 3.17,76.52 1.52,74.87 ARDUINO_DUE1.SCL1 1.52,72.77 2.54,71.75 5.71,71.75 | IC1.6 13.02,72.71 12.06,71.75 6.99,71.75 | 6.35,71.75 5.71,71.75 | 6.35,71.75 6.99,71.75 | X13.4 5.4,60.96 6.35,61.91 6.35,71.12 | 6.35,71.12 6.35,71.75 | 5.71,71.75 6.35,71.12 | 6.35,71.12 6.99,71.75
SDA  (via drill 0.35)
  Top 0.406: v5.4,50.8 5.4,53.66 v7.62,55.88
  Bottom 0.406: ARDUINO_DUE1.20 58.23,65.41 17.14,65.41 v7.62,55.88 | X10.3 1.59,38.1 0.95,38.73 0.95,46.04 1.59,46.67 4.76,46.67 5.4,47.31 5.4,50.16 | 5.4,50.16 4.76,50.8 | 4.76,50.8 X12.3 | 5.4,50.16 5.71,50.48 | 6.03,50.8 R29.1 v5.4,50.8 | 4.76,50.8 v5.4,50.8 | v5.4,50.8 6.03,50.8 | 6.03,50.8 5.71,50.48 | 5.71,50.48 5.4,50.48
SDA1  (via drill 0.35)
  Top 0.406: R36.1 IC1.5 | v1.27,71.75 2.1,71.75 ARDUINO_DUE1.SDA1
  Bottom 0.406: ARDUINO_DUE1.SDA1 4.06,74.87 5.71,76.52 5.71,77.47 | 5.71,78.74 5.71,77.47 | 5.71,78.74 5.71,80.01 5.08,80.64 X11.3 | IC1.5 6.35,78.11 | 6.35,78.11 6.03,78.42 | 6.03,78.42 5.71,78.74 | 6.35,78.11 6.03,77.79 | 5.71,77.47 6.03,77.79 | 6.03,77.79 6.03,78.42 | X13.3 1.27,63.5 0.64,64.14 0.64,71.12 v1.27,71.75
SS  (via drill 0.35)
  Top 0.406: ARDUINO_DUE1.MASTER_RESET_SPI 38.16,48.32 v38.1,48.26
  Bottom 0.406: JP25.5 0.95,27.62 0.95,31.75 2.54,33.34 23.18,33.34 v38.1,48.26
VCC
  Top 0.813: D36.C 45.39,16.82 R32.2
  Top 1.27: ARDUINO_DUE1.VIN 30.78,23.13 34.26,23.13 42.46,14.92 D36.C

### Text on the board
tPlace: G | 5V | I/O | TX3/14 | RX3/15 | TX2/16 | RX2/17 | TX1/18 | RX1/19 | 22 | 23 | 24 | 25 | 26 | 27 | 28 | 29 | 30 | 31 | 32 | 33 | 34 | 35 | 13 | 12 | 11 | 10 | 9 | 8 | 7 | 6 | 5 | 4 | 3 | 2 | I2C_1 | PWM | 37 | G | KOMUNIKASI | 5V | 3V3 | G | 4k7 | SDA1 | EEPROM | SCL1 | 38 | 39 | I2C_1 | 5V | G | G | 3V3 | VR 10K | 40 | SDA1 | G | 5V | 48 | G | 49 | 50 | 51 | 52 | 53 | 5V | G | 41 | SCL1 | 5V | LCD | G | G | ROTARY ENCODER | 3V3 | 42 | SDA | 43 | SCL | I2C_0 | 5V | G | G | 3V3 | 44 | SDA | HEROES / TEAM | UNIVERSITAS / GADJAH MADA | 45 | SCL | 5V | G | SO | 5V | SPI | CK | SI | RESET | 3V3 | 5V | G | G | Vin | 46 | G | 47 | LED1 | LED2 | LED3 | A8 | A9 | A10 | A11 | DAC0 | DAC1 | CANRX | CANTX | 1k | 2k2 | 3k3 | R1 | R2 | R3 | RESET | I/O | D0214 | D0214 | D0214 | 5V | 3V3 | G | 5V | G | Vin | G | G | A0 | A1 | A2 | A3 | A4 | A5 | A6 | A7 | I/O | 5V | G
bPlace: 68 R | R17 | RESISTOR | 68 R | R16 | ZENER 3V3 | 68 R | R15 | R14 | 68 R | R13 | R12 | ZENER 3V3 | 4k7 | 68 R | R11 | ZENER 3V3 | R4 | R5 | 4k7 | R10 | 68 R | R9 | R8 | 68 R | R7 | R6 | SS34 | SS34 | SS34 | D0214 | D0214 | D0214